# Altium schematic sheet BusRaider_SCH_V2_01.schdoc
size 632 x 309 mm
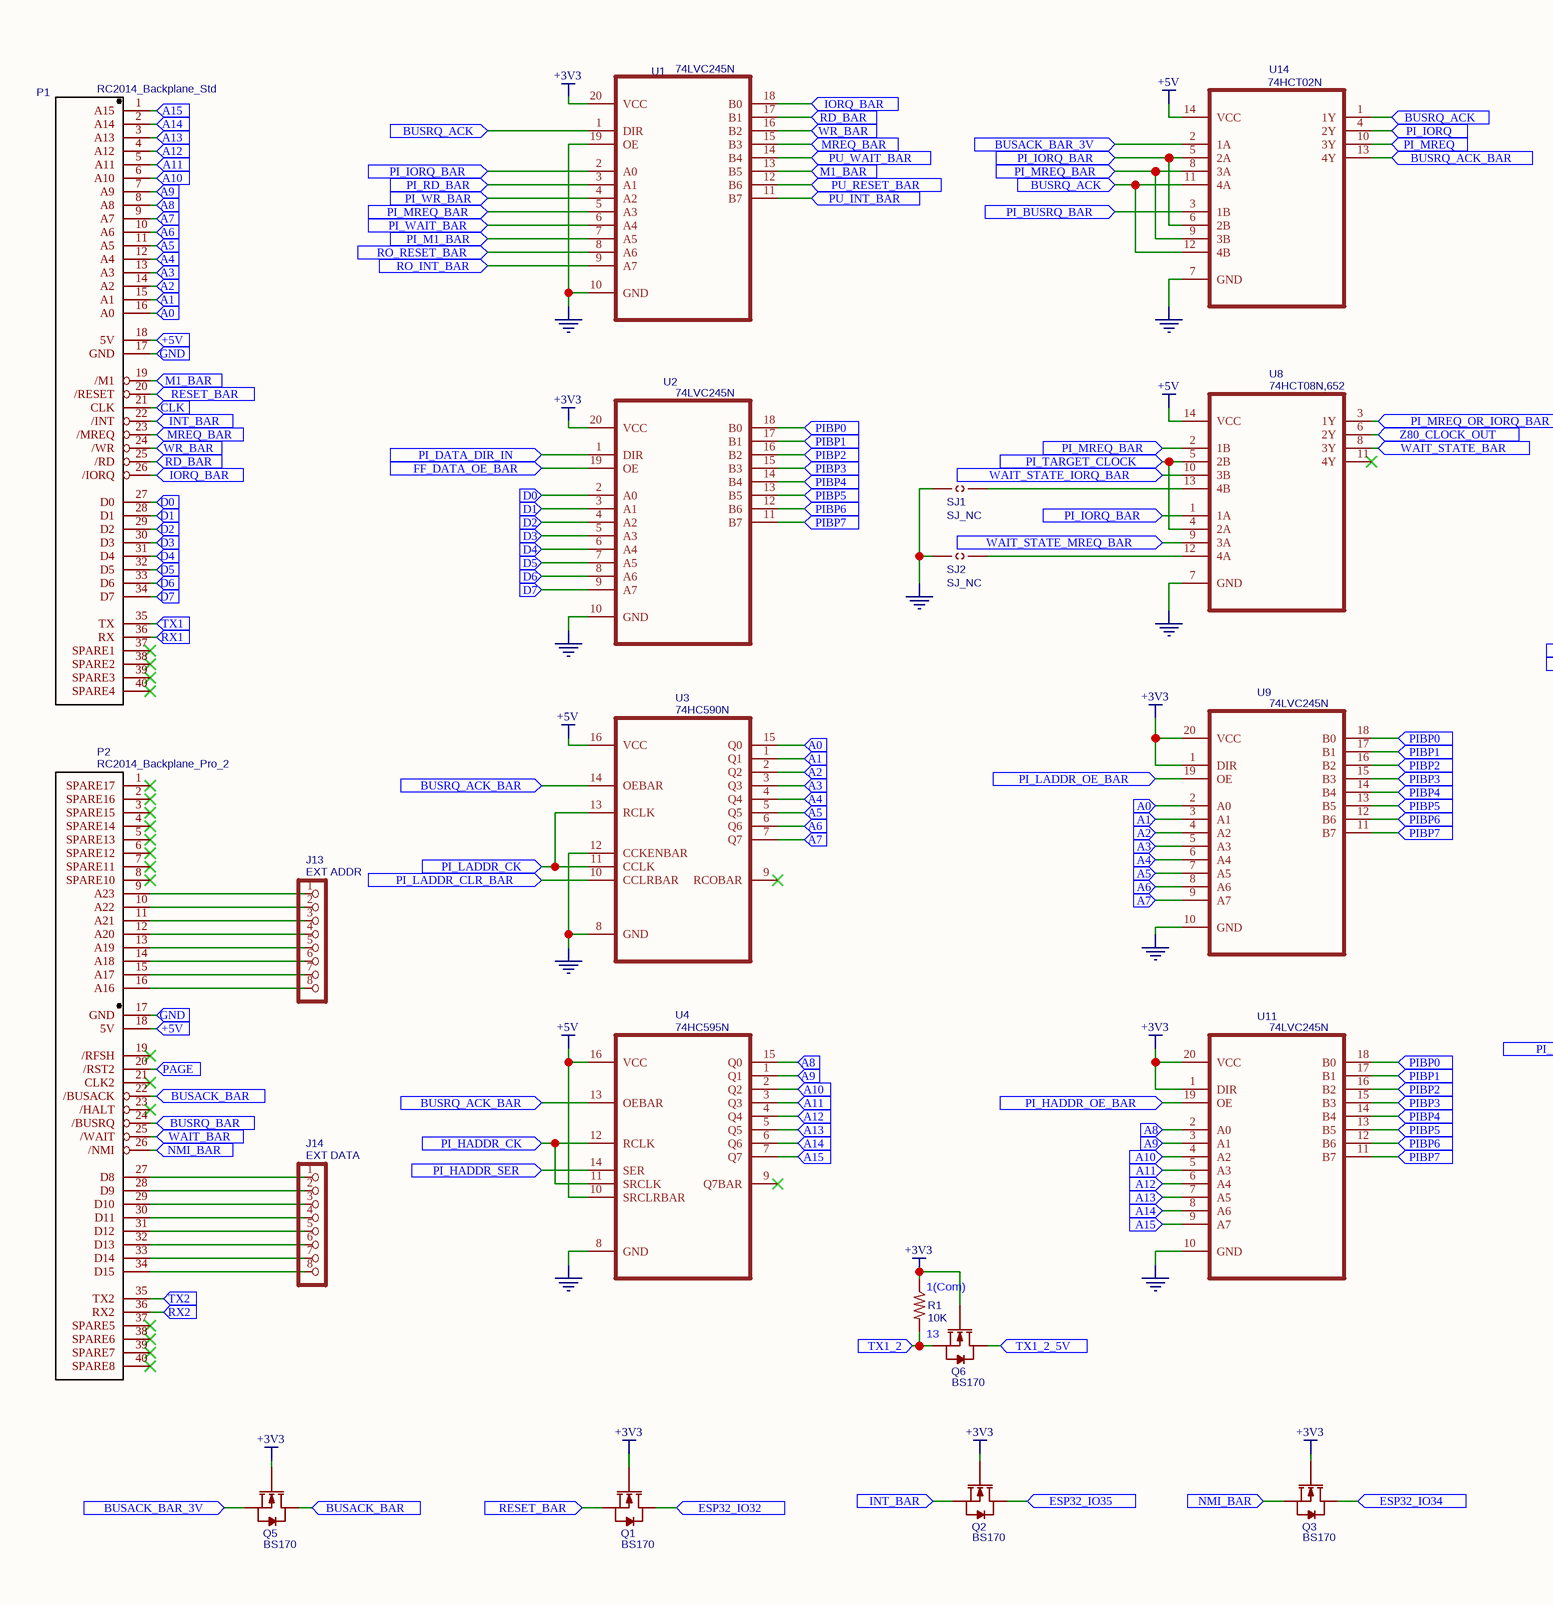
[diagram p0: BusRaider_SCH_V2_01.schdoc, left]
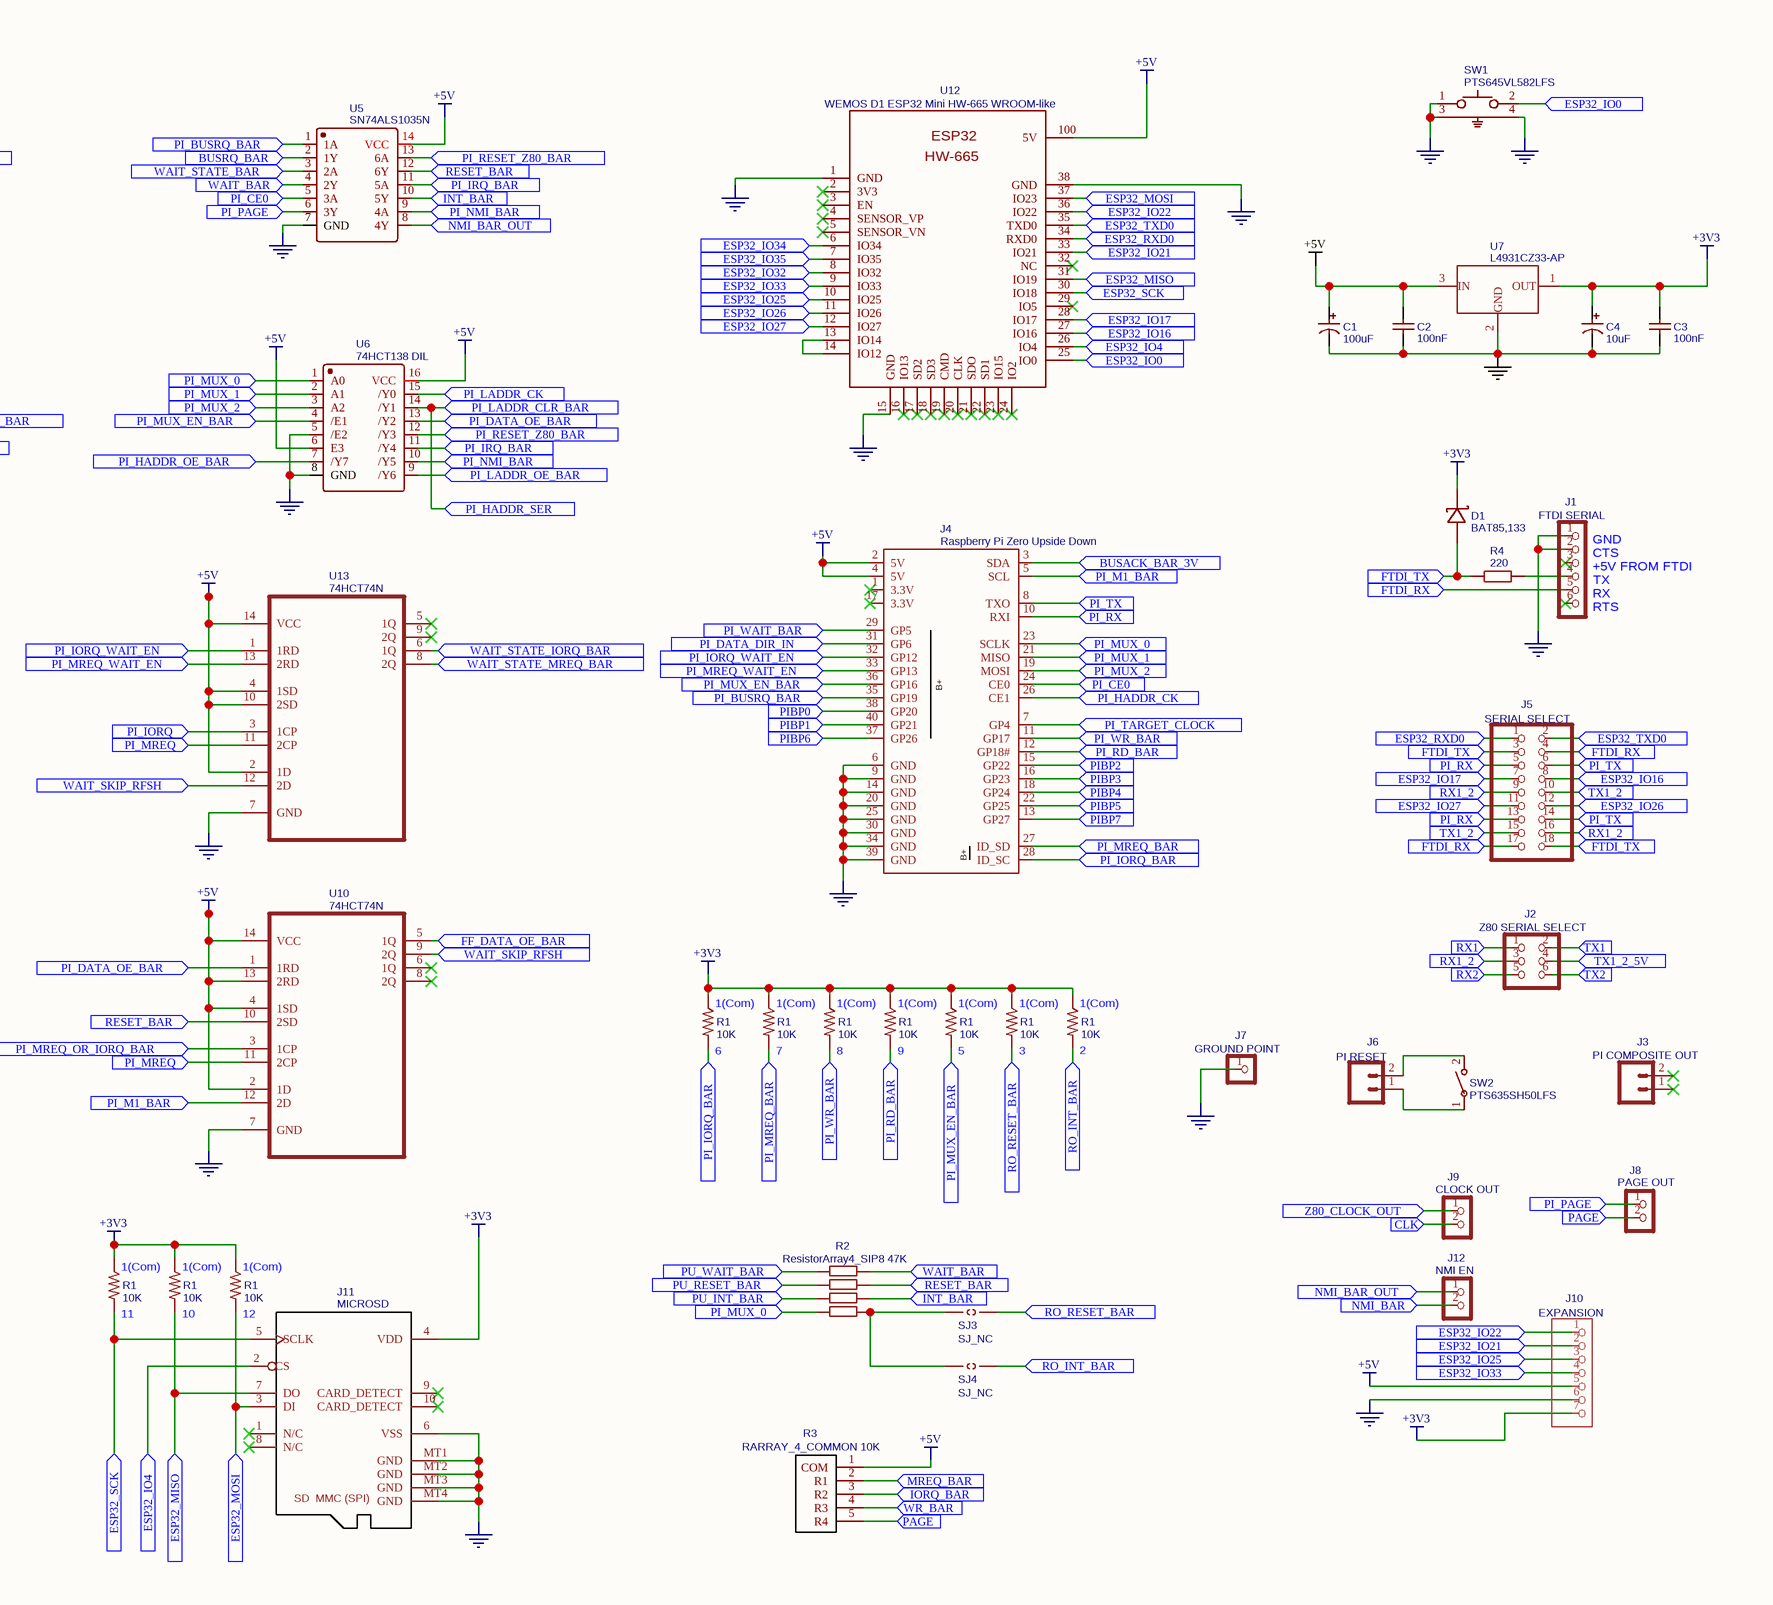
[diagram p1: BusRaider_SCH_V2_01.schdoc, right]

## Parts
(Parts that share a designator on the sheet are numbered #1, #2 ... from top to bottom, then left to right.)
C1  100uF  [CAP-TH_BD5.0-P2.00-D0.8-FD]
C2  100nF  [PKG-CERAMIC CAPACITOR 6X2]
C3  100nF  [PKG-CERAMIC CAPACITOR 6X2]
C4  10uF  [CAP-TH_BD5.0-P2.00-D0.8-FD]
D1  BAT85,133  [DO-34-F]
J1  FTDI SERIAL  [M1X6]
J2  Z80 SERIAL SELECT  [2X03_NO_SILK]
J3  PI COMPOSITE OUT  [1X02_NO_SILK]
J4  Raspberry Pi Zero Upside Down  [PI_ZERO_UPSIDE_DOWN_3_HOLE_OPP]
J5  SERIAL SELECT  [2X09-CLEANBIG]
J6  PI RESET  [1X02_NO_SILK]
J7  GROUND POINT  [M1X2_10_17]
J8  PAGE OUT  [1X02_NO_SILK]
J9  CLOCK OUT  [1X02_NO_SILK]
J10  EXPANSION  [1X07_NO_SILK]
J11  MICROSD  [MOLEX SD-503398-003-2]
J12  NMI EN  [1X02_NO_SILK]
J13  EXT ADDR  [1X08_HEADER_2_54_THRU_NO_SILK]
J14  EXT DATA  [1X08_HEADER_2_54_THRU_NO_SILK]
P1  RC2014_Backplane_Std  [HDR-2.54-1X40P]
P2  RC2014_Backplane_Pro_2  [HDR-2.54-1X40P]
Q1  BS170  [TO-92]
Q2  BS170  [TO-92]
Q3  BS170  [TO-92]
Q5  BS170  [TO-92]
Q6  BS170  [TO-92]
R1#1  10K  [RESISTOR_ARRAY_SIP_13]
R1#2  10K  [RESISTOR_ARRAY_SIP_13]
R1#3  10K  [RESISTOR_ARRAY_SIP_13]
R1#4  10K  [RESISTOR_ARRAY_SIP_13]
R1#5  10K  [RESISTOR_ARRAY_SIP_13]
R1#6  10K  [RESISTOR_ARRAY_SIP_13]
R1#7  10K  [RESISTOR_ARRAY_SIP_13]
R1#8  10K  [RESISTOR_ARRAY_SIP_13]
R1#9  10K  [RESISTOR_ARRAY_SIP_13]
R1#10  10K  [RESISTOR_ARRAY_SIP_13]
R1#11  10K  [RESISTOR_ARRAY_SIP_13]
R2  ResistorArray4_SIP8 47K  [RESISTOR_ARRAY_SIP_8]
R3  RARRAY_4_COMMON 10K  [RARRAY_4_COMMON]
R4  220  [AXIAL-3.2X1.8(1/8W)]
SJ1  SJ_NC  [SJ_NC]
SJ2  SJ_NC  [SJ_NC]
SJ3  SJ_NC  [SJ_NC]
SJ4  SJ_NC  [SJ_NC]
SW1  PTS645VL582LFS  [KEY-TOUCH-DIP-7.5*6.2*5.85]
SW2  PTS635SH50LFS  [KEY-6.0X3.5X3.5]
U1  74LVC245N  [DIP254P762X420-20]
U2  74LVC245N  [DIP254P762X420-20]
U3  74HC590N  [DIP254P762X508-16]
U4  74HC595N  [DIP254P762X508-16]
U5  SN74ALS1035N  [DIP254P762X420-14]
U6  74HCT138 DIL  [DIP254P762X508-16]
U7  L4931CZ33-AP  [TO-92]
U8  74HCT08N,652  [DIP254P762X420-14]
U9  74LVC245N  [DIP254P762X420-20]
U10  74HCT74N  [DIP254P762X420-14]
U11  74LVC245N  [DIP254P762X420-20]
U12  WEMOS D1 ESP32 Mini HW-665 WROOM-like  [WEMOS D1 ESP32]
U13  74HCT74N  [DIP254P762X420-14]
U14  74HCT02N  [DIP254P762X420-14]

## Ports
+5V, A0, A1, A2, A3, A4, A5, A6, A7, A8, A9, A10, A11, A12, A13, A14, A15, BUSACK_BAR, BUSACK_BAR_3V, BUSRQ_ACK, BUSRQ_ACK_BAR, BUSRQ_BAR, CLK, D0, D1, D2, D3, D4, D5, D6, D7, ESP32_IO0, ESP32_IO4, ESP32_IO16, ESP32_IO17, ESP32_IO21, ESP32_IO22, ESP32_IO25, ESP32_IO26, ESP32_IO27, ESP32_IO32, ESP32_IO33, ESP32_IO34, ESP32_IO35, ESP32_MISO, ESP32_MOSI, ESP32_RXD0, ESP32_SCK, ESP32_TXD0, FF_DATA_OE_BAR, FTDI_RX, FTDI_TX, GND, INT_BAR, IORQ_BAR, M1_BAR, MREQ_BAR, NMI_BAR, NMI_BAR_OUT, PAGE, PI_BUSRQ_BAR, PI_CE0, PI_DATA_DIR_IN, PI_DATA_OE_BAR, PI_HADDR_CK, PI_HADDR_OE_BAR, PI_HADDR_SER, PI_IORQ, PI_IORQ_BAR, PI_IORQ_WAIT_EN, PI_IRQ_BAR, PI_LADDR_CK, PI_LADDR_CLR_BAR, PI_LADDR_OE_BAR, PI_M1_BAR, PI_MREQ, PI_MREQ_BAR, PI_MREQ_OR_IORQ_BAR, PI_MREQ_WAIT_EN, PI_MUX_0, PI_MUX_1, PI_MUX_2, PI_MUX_EN_BAR, PI_NMI_BAR, PI_PAGE, PI_RD_BAR, PI_RESET_Z80_BAR, PI_RX, PI_TARGET_CLOCK, PI_TX, PI_WAIT_BAR, PI_WR_BAR, PIBP0, PIBP1, PIBP2, PIBP3, PIBP4, PIBP5, PIBP6, PIBP7, PU_INT_BAR, PU_RESET_BAR, PU_WAIT_BAR, RD_BAR, RESET_BAR, RO_INT_BAR, RO_RESET_BAR, RX1, RX1_2, RX2, TX1, TX1_2, TX1_2_5V, TX2, WAIT_BAR, WAIT_SKIP_RFSH, WAIT_STATE_BAR, WAIT_STATE_IORQ_BAR, WAIT_STATE_MREQ_BAR, WR_BAR, Z80_CLOCK_OUT

## Nets
+3V3: C3.2 C4.1 D1.1(K) J10.7 J11.4(VDD) Q1.2(G) Q2.2(G) Q3.2(G) Q5.2(G) Q6.2(G) R1#1.1 R1#2.1 R1#3.1 R1#4.1 R1#5.1 R1#6.1 R1#7.1 R1#8.1 R1#9.1 R1#10.1 R1#11.1 U1.20(VCC) U2.20(VCC) U7.1(OUT) U9.1(DIR) U9.20(VCC) U11.1(DIR) U11.20(VCC)
+5V: C1.1 C2.2 J4.2(5V) J4.4(5V) J10.5 R3.1(COM) U3.16(VCC) U4.10(SRCLRBAR) U4.16(VCC) U5.14(VCC) U6.6(E3) U6.16(VCC) U7.3(IN) U8.14(VCC) U10.2(1D) U10.4(1SD) U10.13(2RD) U10.14(VCC) U12.100(5V) U13.2(1D) U13.4(1SD) U13.10(2SD) U13.14(VCC) U14.14(VCC)
GND: C1.2 C2.1 C3.1 C4.2 J1.1 J1.2 J4.6(GND) J4.9(GND) J4.14(GND) J4.20(GND) J4.25(GND) J4.30(GND) J4.34(GND) J4.39(GND) J7.1 J10.6 J11.6(VSS) J11.MT1(GND) J11.MT2(GND) J11.MT3(GND) J11.MT4(GND) SJ1.1 SJ2.1 SW1.1 SW1.3 SW1.4 U1.10(GND) U1.19(OE) U2.10(GND) U3.8(GND) U3.12(CCKENBAR) U4.8(GND) U5.7(GND) U6.5(/E2) U6.8(GND) U7.2(GND) U8.7(GND) U9.10(GND) U10.7(GND) U11.10(GND) U12.1(GND) U12.15(GND) U12.38(GND) U13.7(GND) U14.7(GND)
+5V: P1.18(5V) P2.18(5V) ; port +5V  [a separate net that carries the same name]
A0: P1.16(A0) U3.15(Q0) U9.2(A0) ; port A0
A1: P1.15(A1) U3.1(Q1) U9.3(A1) ; port A1
A2: P1.14(A2) U3.2(Q2) U9.4(A2) ; port A2
A3: P1.13(A3) U3.3(Q3) U9.5(A3) ; port A3
A4: P1.12(A4) U3.4(Q4) U9.6(A4) ; port A4
A5: P1.11(A5) U3.5(Q5) U9.7(A5) ; port A5
A6: P1.10(A6) U3.6(Q6) U9.8(A6) ; port A6
A7: P1.9(A7) U3.7(Q7) U9.9(A7) ; port A7
A8: P1.8(A8) U4.15(Q0) U11.2(A0) ; port A8
A9: P1.7(A9) U4.1(Q1) U11.3(A1) ; port A9
A10: P1.6(A10) U4.2(Q2) U11.4(A2) ; port A10
A11: P1.5(A11) U4.3(Q3) U11.5(A3) ; port A11
A12: P1.4(A12) U4.4(Q4) U11.6(A4) ; port A12
A13: P1.3(A13) U4.5(Q5) U11.7(A5) ; port A13
A14: P1.2(A14) U4.6(Q6) U11.8(A6) ; port A14
A15: P1.1(A15) U4.7(Q7) U11.9(A7) ; port A15
BUSACK_BAR: P2.22(/BUSACK) Q5.1(D) ; port BUSACK_BAR
BUSACK_BAR_3V: J4.3(SDA) Q5.3(S) U14.2(1A) ; port BUSACK_BAR_3V
BUSRQ_ACK: U1.1(DIR) U14.1(1Y) U14.11(4A) U14.12(4B) ; port BUSRQ_ACK
BUSRQ_ACK_BAR: U3.14(OEBAR) U4.13(OEBAR) U14.13(4Y) ; port BUSRQ_ACK_BAR
BUSRQ_BAR: P2.24(/BUSRQ) U5.2(1Y) ; port BUSRQ_BAR
CLK: J9.2 P1.21(CLK) ; port CLK
D0: P1.27(D0) U2.2(A0) ; port D0
D1: P1.28(D1) U2.3(A1) ; port D1
D2: P1.29(D2) U2.4(A2) ; port D2
D3: P1.30(D3) U2.5(A3) ; port D3
D4: P1.31(D4) U2.6(A4) ; port D4
D5: P1.32(D5) U2.7(A5) ; port D5
D6: P1.33(D6) U2.8(A6) ; port D6
D7: P1.34(D7) U2.9(A7) ; port D7
ESP32_IO0: SW1.2 U12.25(IO0) ; port ESP32_IO0
ESP32_IO4: J11.2(CS) U12.26(IO4) ; port ESP32_IO4
ESP32_IO16: J5.8 U12.27(IO16) ; port ESP32_IO16
ESP32_IO17: J5.7 U12.28(IO17) ; port ESP32_IO17
ESP32_IO21: J10.2 U12.33(IO21) ; port ESP32_IO21
ESP32_IO22: J10.1 U12.36(IO22) ; port ESP32_IO22
ESP32_IO25: J10.3 U12.10(IO25) ; port ESP32_IO25
ESP32_IO26: J5.12 U12.11(IO26) ; port ESP32_IO26
ESP32_IO27: J5.11 U12.12(IO27) ; port ESP32_IO27
ESP32_IO32: Q1.1(D) U12.8(IO32) ; port ESP32_IO32
ESP32_IO33: J10.4 U12.9(IO33) ; port ESP32_IO33
ESP32_IO34: Q3.1(D) U12.6(IO34) ; port ESP32_IO34
ESP32_IO35: Q2.1(D) U12.7(IO35) ; port ESP32_IO35
ESP32_MISO: J11.7(DO) R1#9.10 U12.31(IO19) ; port ESP32_MISO
ESP32_MOSI: J11.3(DI) R1#10.12 U12.37(IO23) ; port ESP32_MOSI
ESP32_RXD0: J5.1 U12.34(RXD0) ; port ESP32_RXD0
ESP32_SCK: J11.5(SCLK) R1#8.11 U12.30(IO18) ; port ESP32_SCK
ESP32_TXD0: J5.2 U12.35(TXD0) ; port ESP32_TXD0
FF_DATA_OE_BAR: U2.19(OE) U10.5(1Q) ; port FF_DATA_OE_BAR
FTDI_RX: J1.5 J5.4 J5.17 ; port FTDI_RX
FTDI_TX: D1.2(A) J5.3 J5.18 R4.1 ; port FTDI_TX
GND: P1.17(GND) P2.17(GND) ; port GND  [a separate net that carries the same name]
INT_BAR: P1.22(/INT) Q2.3(S) R2.6 U5.10(5Y) ; port INT_BAR
IORQ_BAR: P1.26(/IORQ) R3.3(R2) U1.18(B0) ; port IORQ_BAR
M1_BAR: P1.19(/M1) U1.13(B5) ; port M1_BAR
MREQ_BAR: P1.23(/MREQ) R3.2(R1) U1.15(B3) ; port MREQ_BAR
NMI_BAR: J12.2 P2.26(/NMI) Q3.3(S) ; port NMI_BAR
NMI_BAR_OUT: J12.1 U5.8(4Y) ; port NMI_BAR_OUT
PAGE: J8.2 P2.20(/RST2) R3.5(R4) ; port PAGE
PI_BUSRQ_BAR: J4.35(GP19) U5.1(1A) U14.3(1B) ; port PI_BUSRQ_BAR
PI_CE0: J4.24(CE0) U5.5(3A) ; port PI_CE0
PI_DATA_DIR_IN: J4.31(GP6) U2.1(DIR) ; port PI_DATA_DIR_IN
PI_DATA_OE_BAR: U6.13(/Y2) U10.1(1RD) ; port PI_DATA_OE_BAR
PI_HADDR_CK: J4.26(CE1) U4.11(SRCLK) U4.12(RCLK) ; port PI_HADDR_CK
PI_HADDR_OE_BAR: U6.7(/Y7) U11.19(OE) ; port PI_HADDR_OE_BAR
PI_HADDR_SER: U3.10(CCLRBAR) U4.14(SER) U6.14(/Y1) ; port PI_HADDR_SER, port PI_LADDR_CLR_BAR
PI_IORQ: U13.3(1CP) U14.4(2Y) ; port PI_IORQ
PI_IORQ_BAR: J4.28(ID_SC) R1#1.6 U1.2(A0) U8.1(1A) U14.5(2A) U14.6(2B) ; port PI_IORQ_BAR
PI_IORQ_WAIT_EN: J4.32(GP12) U13.1(1RD) ; port PI_IORQ_WAIT_EN
PI_IRQ_BAR: U5.11(5A) U6.11(/Y4) ; port PI_IRQ_BAR
PI_LADDR_CK: U3.11(CCLK) U3.13(RCLK) U6.15(/Y0) ; port PI_LADDR_CK
PI_LADDR_OE_BAR: U6.9(/Y6) U9.19(OE) ; port PI_LADDR_OE_BAR
PI_M1_BAR: J4.5(SCL) U1.7(A5) U10.12(2D) ; port PI_M1_BAR
PI_MREQ: U10.11(2CP) U13.11(2CP) U14.10(3Y) ; port PI_MREQ
PI_MREQ_BAR: J4.27(ID_SD) R1#2.7 U1.5(A3) U8.2(1B) U14.8(3A) U14.9(3B) ; port PI_MREQ_BAR
PI_MREQ_OR_IORQ_BAR: U8.3(1Y) U10.3(1CP) ; port PI_MREQ_OR_IORQ_BAR
PI_MREQ_WAIT_EN: J4.33(GP13) U13.13(2RD) ; port PI_MREQ_WAIT_EN
PI_MUX_0: J4.23(SCLK) R2.7 U6.1(A0) ; port PI_MUX_0
PI_MUX_1: J4.21(MISO) U6.2(A1) ; port PI_MUX_1
PI_MUX_2: J4.19(MOSI) U6.3(A2) ; port PI_MUX_2
PI_MUX_EN_BAR: J4.36(GP16) R1#5.5 U6.4(/E1) ; port PI_MUX_EN_BAR
PI_NMI_BAR: U5.9(4A) U6.10(/Y5) ; port PI_NMI_BAR
PI_PAGE: J8.1 U5.6(3Y) ; port PI_PAGE
PI_RD_BAR: J4.12(GP18#) R1#4.9 U1.3(A1) ; port PI_RD_BAR
PI_RESET_Z80_BAR: U5.13(6A) U6.12(/Y3) ; port PI_RESET_Z80_BAR
PI_RX: J4.10(RXI) J5.5 J5.13 ; port PI_RX
PI_TARGET_CLOCK: J4.7(GP4) U8.4(2A) U8.5(2B) ; port PI_TARGET_CLOCK
PI_TX: J4.8(TXO) J5.6 J5.14 ; port PI_TX
PI_WAIT_BAR: J4.29(GP5) U1.6(A4) ; port PI_WAIT_BAR
PI_WR_BAR: J4.11(GP17) R1#3.8 U1.4(A2) ; port PI_WR_BAR
PIBP0: J4.38(GP20) U2.18(B0) U9.18(B0) U11.18(B0) ; port PIBP0
PIBP1: J4.40(GP21) U2.17(B1) U9.17(B1) U11.17(B1) ; port PIBP1
PIBP2: J4.15(GP22) U2.16(B2) U9.16(B2) U11.16(B2) ; port PIBP2
PIBP3: J4.16(GP23) U2.15(B3) U9.15(B3) U11.15(B3) ; port PIBP3
PIBP4: J4.18(GP24) U2.14(B4) U9.14(B4) U11.14(B4) ; port PIBP4
PIBP5: J4.22(GP25) U2.13(B5) U9.13(B5) U11.13(B5) ; port PIBP5
PIBP6: J4.37(GP26) U2.12(B6) U9.12(B6) U11.12(B6) ; port PIBP6
PIBP7: J4.13(GP27) U2.11(B7) U9.11(B7) U11.11(B7) ; port PIBP7
PU_INT_BAR: R2.5 U1.11(B7) ; port PU_INT_BAR
PU_RESET_BAR: R2.3 U1.12(B6) ; port PU_RESET_BAR
PU_WAIT_BAR: R2.1 U1.14(B4) ; port PU_WAIT_BAR
RD_BAR: P1.25(/RD) U1.17(B1) ; port RD_BAR
RESET_BAR: P1.20(/RESET) Q1.3(S) R2.4 U5.12(6Y) U10.10(2SD) ; port RESET_BAR
RO_INT_BAR: R1#7.2 SJ4.2 U1.9(A7) ; port RO_INT_BAR
RO_RESET_BAR: R1#6.3 SJ3.2 U1.8(A6) ; port RO_RESET_BAR
RX1: J2.1 P1.36(RX) ; port RX1
RX1_2: J2.3 J5.9 J5.16 ; port RX1_2
RX2: J2.5 P2.36(RX2) ; port RX2
TX1: J2.2 P1.35(TX) ; port TX1
TX1_2: J5.10 J5.15 Q6.3(S) R1#11.13 ; port TX1_2
TX1_2_5V: J2.4 Q6.1(D) ; port TX1_2_5V
TX2: J2.6 P2.35(TX2) ; port TX2
WAIT_BAR: P2.25(/WAIT) R2.2 U5.4(2Y) ; port WAIT_BAR
WAIT_SKIP_RFSH: U10.9(2Q) U13.12(2D) ; port WAIT_SKIP_RFSH
WAIT_STATE_BAR: U5.3(2A) U8.8(3Y) ; port WAIT_STATE_BAR
WAIT_STATE_IORQ_BAR: U8.10(3B) U13.6(1Q) ; port WAIT_STATE_IORQ_BAR
WAIT_STATE_MREQ_BAR: U8.9(3A) U13.8(2Q) ; port WAIT_STATE_MREQ_BAR
WR_BAR: P1.24(/WR) R3.4(R3) U1.16(B2) ; port WR_BAR
Z80_CLOCK_OUT: J9.1 U8.6(2Y) ; port Z80_CLOCK_OUT
NetJ1_4: J1.4 R4.2
NetJ6_1: J6.1 SW2.1
NetJ6_2: J6.2 SW2.2
NetJ13_1: J13.1 P2.9(A23)
NetJ13_2: J13.2 P2.10(A22)
NetJ13_3: J13.3 P2.11(A21)
NetJ13_4: J13.4 P2.12(A20)
NetJ13_5: J13.5 P2.13(A19)
NetJ13_6: J13.6 P2.14(A18)
NetJ13_7: J13.7 P2.15(A17)
NetJ13_8: J13.8 P2.16(A16)
NetJ14_1: J14.1 P2.27(D8)
NetJ14_2: J14.2 P2.28(D9)
NetJ14_3: J14.3 P2.29(D10)
NetJ14_4: J14.4 P2.30(D11)
NetJ14_5: J14.5 P2.31(D12)
NetJ14_6: J14.6 P2.32(D13)
NetJ14_7: J14.7 P2.33(D14)
NetJ14_8: J14.8 P2.34(D15)
NetR2_8: R2.8 SJ3.1 SJ4.1
NetSJ1_2: SJ1.2 U8.13(4B)
NetSJ2_2: SJ2.2 U8.12(4A)
NetU12_13: U12.13(IO14) U12.14(IO12)

Not connected (* = marked no-connect by the designer): J1 3* 6*; J3 1* 2*; J4 1(3.3V)* 17(3.3V)*; J11 1(N/C)* 8(N/C)* 9(CARD_DETECT)* 10(CARD_DETECT)*; P1 37(SPARE1)* 38(SPARE2)* 39(SPARE3)* 40(SPARE4)*; P2 1(SPARE17)* 2(SPARE16)* 3(SPARE15)* 4(SPARE14)* 5(SPARE13)* 6(SPARE12)* 7(SPARE11)* 8(SPARE10)* 19(/RFSH)* 21(CLK2)* 23(/HALT)* 37(SPARE5)* 38(SPARE6)* 39(SPARE7)* 40(SPARE8)*; U3 9(RCOBAR)*; U4 9(Q7BAR)*; U8 11(4Y)*; U10 6(1Q)* 8(2Q)*; U12 2(3V3)* 3(EN)* 4(SENSOR_VP)* 5(SENSOR_VN)* 16(IO13)* 17(SD2)* 18(SD3)* 19(CMD)* 20(CLK)* 21(SDO)* 22(SD1)* 23(IO15)* 24(IO2)* 29(IO5)* 32(NC)*; U13 5(1Q)* 9(2Q)*

## Notes on the sheet
- (near J1) CTS
- (near J1) +5V FROM FTDI
- (near J1) GND
- (near J1) RTS
- (near J1) RX
- (near J1) TX
- (in symbol 10K) 1(Com)
- (in symbol MICROSD) SD  MMC (SPI)
- (in symbol Raspberry Pi Zero Upside Down) B+
- (in symbol WEMOS D1 ESP32 Mini HW-665 WROOM-like) ESP32; HW-665

## Library data of the parts
C1 = 100uF: BOM_Manufacturer: ValuePro; BOM_Manufacturer Part: 100uf/10V; nameAlias: Capacitance; BOM_Supplier: LCSC; BOM_Supplier Part: C2035; spicePre: C; spiceSymbolName: 100uf/10V
C2 C3 = 100nF: BOM_Manufacturer Part: MCFYU6104Z6; Voltage: 100V; Tolerance: ±20%; Contributor: Prof. Ing. F. Scordino; Value: 100nF; BOM_Supplier Part: 9411887; BOM_Supplier: Element14; Link: http://www.farnell.com/datasheets/296858.pdf?_ga=2.179112227.664711881.1510158588-238689616.1505921947&_gac=1.162203016.1510158588.EAIaIQobChMIqoD3jrOv1wIVgwrTCh2CCwl7EAAYASAAEgKQo_D_BwE; spicePre: C
C4 = 10uF: BOM_Manufacturer: ValuePro; BOM_Manufacturer Part: 100uf/10V; nameAlias: Capacitance; BOM_Supplier: LCSC; BOM_Supplier Part: C2035; spicePre: C; spiceSymbolName: 100uf/10V
D1 = BAT85,133: BOM_Manufacturer: Nexperia; Contributor: LCSC; BOM_Supplier: LCSC; BOM_Manufacturer Part: BAT85,133; BOM_Supplier Part: C134301; spicePre: D
J1 = FTDI SERIAL: Contributor: DangerousPrototype; spicePre: J
J2 = Z80 SERIAL SELECT: Contributor: DangerousPrototype; sourceId: 5oAa8IGDB; timeStamp: 1471786281; spicePre: J
J3 = PI COMPOSITE OUT: description: Standard 2-pin 0.1 header. Use with; Contributor: SparkFun; spicePre: J
J4 = Raspberry Pi Zero Upside Down: description: Raspberry Pi B+ GPIO Header; Contributor: robdobsn; spicePre: J
J5 = SERIAL SELECT: description: PIN HEADER; Contributor: Adafruit; spicePre: J
J6 = PI RESET: description: Standard 2-pin 0.1 header. Use with; Contributor: SparkFun; spicePre: J
J7 = GROUND POINT: Contributor: DangerousPrototype; spicePre: J
J8 = PAGE OUT: catid: 20; Contributor: DangerousPrototype; sourceId: t7e82kCUO; BOM_Manufacturer Part: ?; spicePre: J
J9 = CLOCK OUT: catid: 20; Contributor: DangerousPrototype; sourceId: t7e82kCUO; BOM_Manufacturer Part: ?; spicePre: J
J10 = EXPANSION: Contributor: robdobsn; spicePre: J
J11 = MICROSD: BOM_Manufacturer: Molex; BOM_Manufacturer part: 5033981892; BOM_Supplier: Digi-Key; BOM_Manufacturer Part: ?; spicePre: J; BOM_Supplier Part: WM11190CT-ND
J12 = NMI EN: catid: 20; Contributor: DangerousPrototype; sourceId: t7e82kCUO; BOM_Manufacturer Part: ?; spicePre: J
J13 = EXT ADDR: Contributor: robdobsn; spicePre: J
J14 = EXT DATA: Contributor: robdobsn; spicePre: J
P1 = RC2014_Backplane_Std: Contributor: robdobsn; spicePre: X; BOM_Supplier Part: C74252; BOM_Supplier: LCSC
P2 = RC2014_Backplane_Pro_2: Contributor: robdobsn; spicePre: X; BOM_Supplier Part: C74252
Q1-Q3 Q5 Q6 = BS170: BOM_Manufacturer: FAIRCHILD; BOM_Supplier: LCSC; BOM_Manufacturer Part: BS170; BOM_Supplier Part: C111691; spicePre: Q
R1#1 R1#2 R1#5-R1#7 R1#9-R1#11 = 10K: subpart_no: 12; Contributor: robdobsn; spicePre: R
R1#3 = 10K: subpart_no: 7; Contributor: robdobsn; spicePre: R
R1#4 = 10K: subpart_no: 8; Contributor: robdobsn; spicePre: R
R1#8 = 10K: subpart_no: 10; Contributor: robdobsn; spicePre: R
R2 = ResistorArray4_SIP8 47K: Contributor: robdobsn; spicePre: R
R3 = RARRAY_4_COMMON 10K: BOM_Manufacturer Part: 4605X-AP1-103LF; BOM_Manufacturer: Bourns; Contributor: robdobsn; link: none; BOM_Supplier Part: 652-4605X-AP1-103LF; spicePre: R
R4 = 220: BOM_Manufacturer: Chian Chia Elec; nameAlias: Resistance (Ohms); Contributor: LCSC; BOM_Supplier: LCSC; BOM_Supplier Part: C119161; BOM_Manufacturer Part: -; spicePre: R; spiceSymbolName: MF1/8W-160Ω±1% T52
SJ1-SJ4 = SJ_NC: description: Solder Jumper; Contributor: robdobsn; spicePre: S
SW1 = PTS645VL582LFS: BOM_Manufacturer: C&K; Contributor: LCSC; BOM_Supplier: LCSC; BOM_Supplier Part: C285524; BOM_Manufacturer Part: PTS645VL582LFS; spicePre: S
SW2 = PTS635SH50LFS: BOM_Manufacturer: C&K; Contributor: LCSC; BOM_Supplier: LCSC; BOM_Supplier Part: C221866; BOM_Manufacturer Part: PTS635SH50LFS; spicePre: S
U1 U2 U9 U11 = 74LVC245N: description: Octal bus transceiver; Contributor: robdobsn; spicePre: U
U3 = 74HC590N: description: Octal counter 3 state; Contributor: robdobsn; spicePre: U
U4 = 74HC595N: description: Octal counter 3 state; Contributor: robdobsn; spicePre: U
U5 = SN74ALS1035N: Contributor: robdobsn; spicePre: X
U6 = 74HCT138 DIL: BOM_Manufacturer: FM; BOM_Manufacturer Part: 74HC138; BOM_Supplier Part: C86611; BOM_Supplier: LCSC; spicePre: U
U7 = L4931CZ33-AP: description: DIP PMIC Voltage Regulators LDO 3.3V 250mA;; sourceId: MAoK6rNxT; timeStamp: 1448010622; BOM_Manufacturer Part: L4931CZ33-AP; spicePre: U
U8 = 74HCT08N,652: description: Quad 2-input NAND gate; Contributor: robdobsn; spicePre: U
U10 U13 = 74HCT74N: description: Dual D-type flip-flop with set and reset positive-edge trigger; Contributor: Guest; spicePre: U
U12 = WEMOS D1 ESP32 Mini HW-665 WROOM-like: Contributor: robdobsn; BOM_Manufacturer: WEMOS; BOM_Supplier: WEMOS; BOM_Supplier Part: WEMOS_D1_ESP32; spicePre: U
U14 = 74HCT02N: description: Quad 2-input NOR gate; Contributor: Guest; spicePre: U